# EAGLE design ADMP441_BreakoutBoard (EAGLE 6.3)
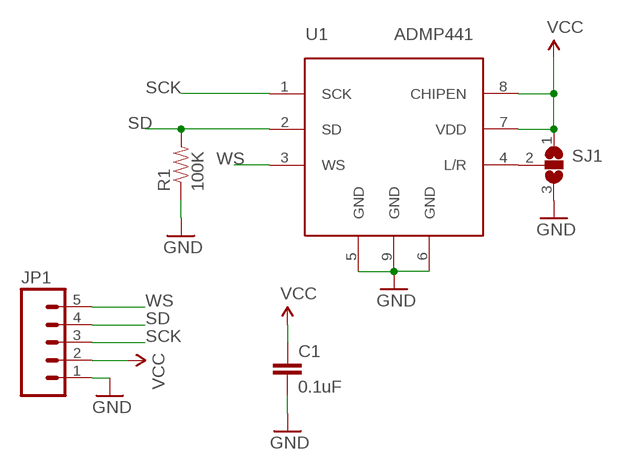
[diagram p0: schematic, sheet 1]

## Parts
C1  0.1uF  CAP0603-CAP  [0603-CAP]
JP1  M05PTH  [1X05]
R1  100K  RESISTOR0603-RES  [0603-RES]
SJ1  SJ2W  [SJ_2]
U1  ADMP441  [ADMP441]

## Nets
GND: C1.2 JP1.1 R1.1 SJ1.3 U1.5(GND) U1.6(GND) U1.9(GND)
N$6: SJ1.2 U1.4(L/R)
SCK: JP1.3 U1.1(SCK)
SD: JP1.4 R1.2 U1.2(SD)
VCC: C1.1 JP1.2 SJ1.1 U1.7(VDD) U1.8(CHIPEN)
WS: JP1.5 U1.3(WS)

## Library data of the parts
C1 = SparkFun-Passives:CAP: Capacitor Standard 0603 ceramic capacitor, and 0.1" leaded capacitor.
JP1 = SparkFun-Connectors:M05: Header 5 Standard 5-pin 0.1" header. Use with straight break away headers (SKU : PRT-00116), right angle break away headers (PRT-00553), swiss pins (PRT-00743), machine pins (PRT-00117), and female headers (PRT-00115). Molex polarized connector foot print use with SKU : PRT-08230 with associated crimp pins and housings.
R1 = SparkFun-Passives:RESISTOR: Resistor Basic schematic elements and footprints for 0603, 1206, and PTH resistors.
SJ1 = jumper:SJ2W: SMD solder JUMPER
U1 = ADMP441:ADMP441

## Board
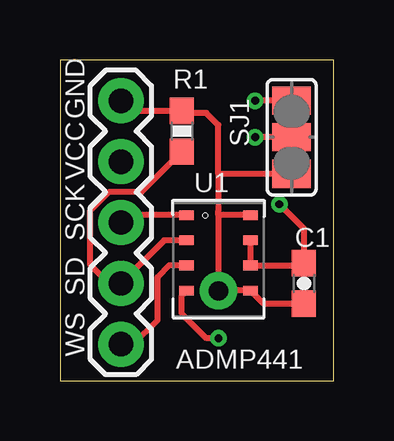
[diagram p1: board, top side]
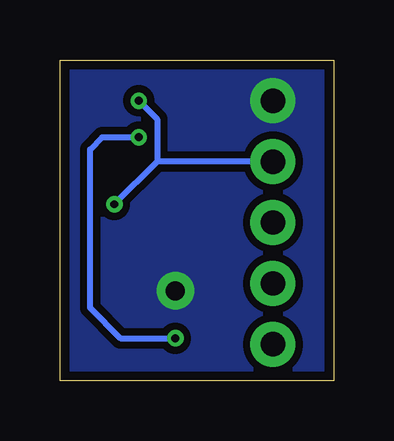
[diagram p2: board, bottom side, seen from below]

Size 11.41 x 13.39 mm. Coordinates in mm from the lower left corner, seen from the top.
Outline: 0,0 11.41,0 11.41,13.39 0,13.39 0,0
Copper layers (1*16): Top 0.0356mm / dielectric 1.5011mm / Bottom 0.0356mm
Design rules "LaenPCBOrder *": minimum track width 6mil, minimum drill 13mil, track to track 6mil, track to pad 6mil, pad to pad 6mil, via to via 6mil, smd to smd 6mil, copper to edge 15mil, drill to drill 6mil, minimum pad ring 7mil, minimum via ring 7mil, stop-mask expansion 4mil, vias tented up to drill 13mil, thermal gap 10mil

### Footprints (pad centres in the part's own frame; a part is rotated, then mirrored left to right if it is on the bottom)
0603-CAP = smd 1.1 x 1: 1 -0.85,0; 2 0.85,0
1X05 = drill 1.016 pad 1.88: 1 0,0; 2 2.54,0; 3 5.08,0; 4 7.62,0; 5 10.16,0
0603-RES = smd 1.1 x 1: 1 -0.85,0; 2 0.85,0
SJ_2 = smd 1.168 x 1.6: 1 -1.524,0; 2 0,0; 3 1.524,0
ADMP441 = smd 0.6 x 0.4: 1 -1.33,1.58; 2 -1.33,0.53; 3 -1.33,-0.52; 4 -1.33,-1.57; 6 1.33,-1.57; 7 1.33,-0.52; 8 1.33,0.53; 9 1.33,1.58 | drill 0.8 pad 1.56: 5 0,-1.58

### Placement (x,y rotation side)
C1  10.16,4.06 270 top
JP1  2.54,11.68 270 top
R1  5.08,10.41 270 top
SJ1  9.65,10.16 270 top
U1  6.6,5.33 0 top

### Tracks (layer width: path | path; a pad name or v marks a point on that pad's centre or on a via)
GND
  Top 0.254: C1.2 8.48,3.21 U1.6 6.61,3.76 U1.5 6.6,6.91 | 7.87,6.97 U1.9 6.6,6.91 | 6.6,8.64 6.6,7.11 6.6,6.91 | JP1.1 2.96,11.26 R1.1 5.17,11.18 6.1,11.18 6.6,10.67 6.6,8.64 | SJ1.3 6.6,8.64
  pour Bottom (isolate 0.305, no thermals): 0,0 0,13.46 11.43,13.46 11.43,0
N$6  (via drill 0.33)
  Top 0.254: U1.4 5.08,3.57 5.08,2.79 6.1,1.78 v6.6,1.78 | SJ1.2 v8.13,10.16
  Bottom 0.254: v6.6,1.78 8.89,1.78 10.16,3.05 10.16,9.65 SJ1.2 v8.13,10.16
SCK
  Top 0.254: U1.1 2.85,6.91 JP1.3
SD
  Top 0.254: U1.2 4.34,5.86 JP1.4 2.03,4.06 1.27,4.83 1.27,7.11 2.03,7.87 3.39,7.87 R1.2
VCC  (via drill 0.33)
  Top 0.254: U1.8 U1.7 10.31,4.81 C1.1 10.16,6.35 v9.14,7.37 | SJ1.1 v8.13,11.68
  Bottom 0.254: JP1.2 7.37,9.14 | 7.37,9.14 v9.14,7.37 | v8.13,11.68 7.37,10.92 7.37,9.14
WS
  Top 0.254: JP1.5 3.06,1.52 4.06,2.53 4.06,4.32 4.56,4.81 U1.3

### Text on the board
tNames: GND | VCC | SCK | SD | WS